# EAGLE schematic Atmega328 (EAGLE 7.2.0)
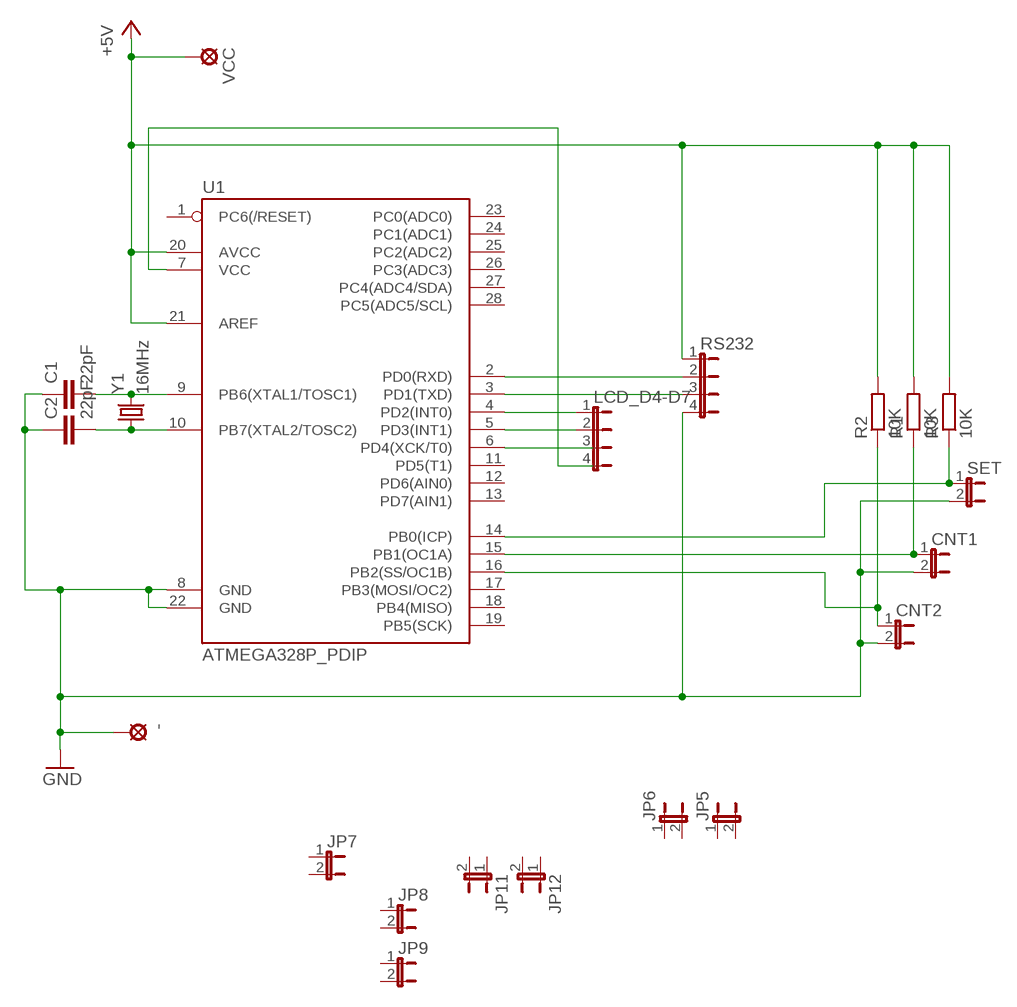
[diagram p0: schematic, sheet 1]

## Parts
-  LSP10  [LSP10]
C1  22pF  C-EU025-024X044  [C025-024X044]
C2  22pF  C-EU025-024X044  [C025-024X044]
CNT1  JP1E  [JP1]
CNT2  JP1E  [JP1]
JP5  JP1E  [JP1]
JP6  JP1E  [JP1]
JP7  JP1E  [JP1]
JP8  JP1E  [JP1]
JP9  JP1E  [JP1]
JP11  JP1E  [JP1]
JP12  JP1E  [JP1]
LCD_D4-D7  JP4E  [JP4]
R1  10K  R-EU_0204/7  [0204/7]
R2  10K  R-EU_0204/7  [0204/7]
R3  10K  R-EU_0204/7  [0204/7]
RS232  JP4E  [JP4]
SET  JP1E  [JP1]
U1  ATMEGA328P_PDIP  [DIL28-3]
VCC  LSP10  [LSP10]
Y1  16MHz  CRYSTALHC49US  [HC49US]

## Nets
+5V: R1.2 R2.2 R3.2 RS232.1 U1.20(AVCC) U1.21(AREF) VCC.MP
GND: -.MP C1.1 C2.1 CNT1.2 CNT2.2 RS232.4 SET.2 U1.8(GND) U1.22(GND)
N$1: RS232.2 U1.2(PD0(RXD))
N$2: RS232.3 U1.3(PD1(TXD))
N$3: C1.2 U1.9(PB6(XTAL1/TOSC1)) Y1.2
N$4: C2.2 U1.10(PB7(XTAL2/TOSC2)) Y1.1
N$5: LCD_D4-D7.1 U1.4(PD2(INT0))
N$6: LCD_D4-D7.2 U1.5(PD3(INT1))
N$7: U1.6(PD4(XCK/T0))
N$8: U1.7(VCC)
N$9: R3.1 SET.1 U1.14(PB0(ICP))
N$10: CNT1.1 R1.1 U1.15(PB1(OC1A))
N$11: CNT2.1 R2.1 U1.16(PB2(SS/OC1B))
Unconnected: JP5.1 JP5.2 JP6.1 JP6.2 JP7.1 JP7.2 JP8.1 JP8.2 JP9.1 JP9.2 JP11.1 JP11.2 JP12.1 JP12.2 LCD_D4-D7.3 LCD_D4-D7.4 U1.1(PC6(/RESET)) U1.11(PD5(T1)) U1.12(PD6(AIN0)) U1.13(PD7(AIN1)) U1.17(PB3(MOSI/OC2)) U1.18(PB4(MISO)) U1.19(PB5(SCK)) U1.23(PC0(ADC0)) U1.24(PC1(ADC1)) U1.25(PC2(ADC2)) U1.26(PC3(ADC3)) U1.27(PC4(ADC4/SDA)) U1.28(PC5(ADC5/SCL))

## Library data of the parts
- VCC = solpad:LSP10: SOLDER PAD drill 1.0 mm, distributor Buerklin, 12H555
C1 C2 = rcl:C-EU: CAPACITOR, European symbol
CNT1 CNT2 JP5-JP9 JP11 JP12 SET = jumper:JP1E: JUMPER
LCD_D4-D7 RS232 = jumper:JP4E: JUMPER
R1-R3 = rcl:R-EU_: RESISTOR, European symbol
U1 = SparkFun-DigitalIC:ATMEGA328P_PDIP: uC used in the Arduino 32kb flash, 1k EEPROM, 2k SRAM This is the through-hole version of this chip.
Y1 = SparkFun-FreqCtrl:CRYSTAL: Various standard crystals. Proven footprints.